# EasyEDA schematic V2.json
TITLE: Sheet_1; REV: 1.0; Date: 2022-11-14; Sheet: 1/1; Company: Your Company
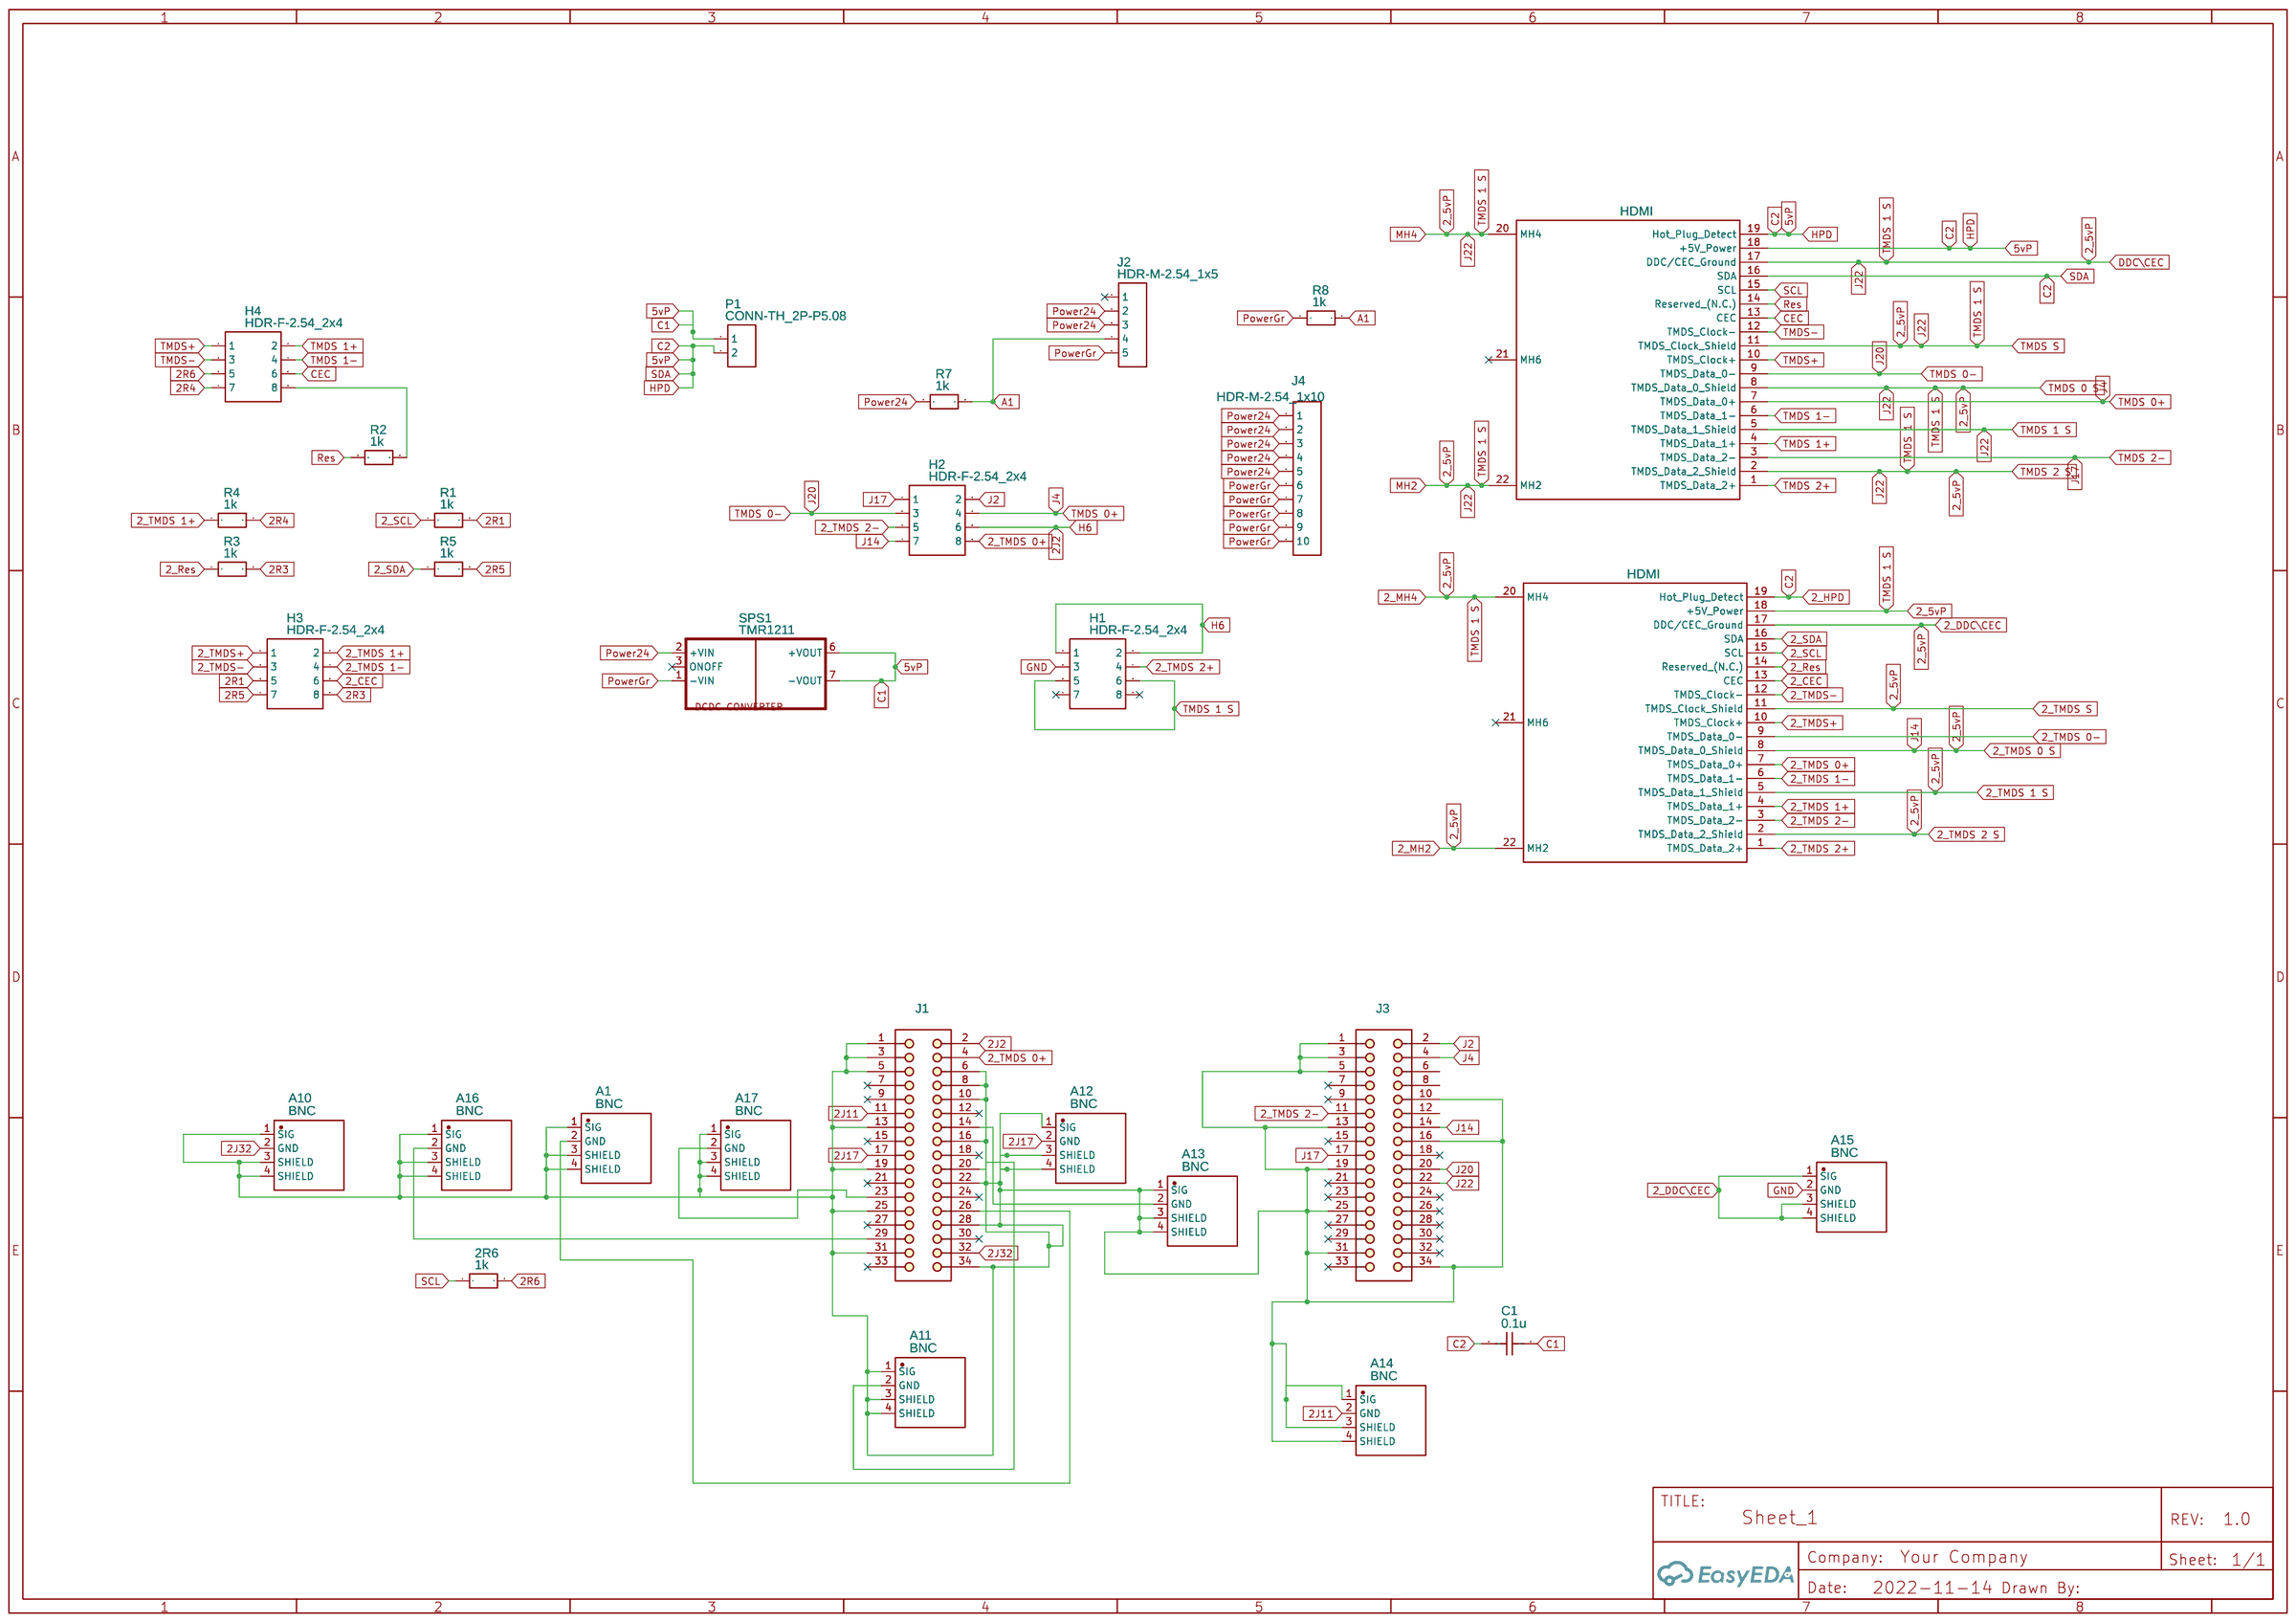
[diagram p0: schematic sheet]

## Parts
2R6  1k  [R0603]
A1  BNC  [BNC-TH_DOSIN-801-0039]
A10  BNC  [BNC-TH_DOSIN-801-0039]
A11  BNC  [BNC-TH_DOSIN-801-0039]
A12  BNC  [BNC-TH_DOSIN-801-0039]
A13  BNC  [BNC-TH_DOSIN-801-0039]
A14  BNC  [BNC-TH_DOSIN-801-0039]
A15  BNC  [BNC-TH_DOSIN-801-0039]
A16  BNC  [BNC-TH_DOSIN-801-0039]
A17  BNC  [BNC-TH_DOSIN-801-0039]
C1  0.1u  [C0603]
H1  HDR-F-2.54_2x4  [HDR-F-2.54_2X4]
H2  HDR-F-2.54_2x4  [HDR-F-2.54_2X4]
H3  HDR-F-2.54_2x4  [HDR-F-2.54_2X4]
H4  HDR-F-2.54_2x4  [HDR-F-2.54_2X4]
J1  09 18 134 9621  [9181349621]
J2  HDR-M-2.54_1x5  [HDR-M-2.54_1X5]
J3  09 18 134 9621  [9181349621]
J4  HDR-M-2.54_1x10  [HDR-M-2.54_1X10]
P1  CONN-TH_2P-P5.08  [CONN-TH_2P-P5.08]
R1  1k  [R0603]
R2  1k  [R0603]
R3  1k  [R0603]
R4  1k  [R0603]
R5  1k  [R0603]
R7  1k  [R0603]
R8  1k  [R0603]
SPS1  TMR1211  [TRACO_SIP-8]
U1  HDMI  [HDMI-SMD_SOFNG_HDMI-019L-S]
U2  HDMI  [HDMI-SMD_SOFNG_HDMI-019L-S]

## Library data of the parts
2R6 R1-R5 R7 R8 = R_0603_EU: Contributor: LCEDA_Lib
A1 A10-A17 = DOSIN-801-0039: Supplier: LCSC; Supplier Part: C709674; Manufacturer: dosinconn(德索五金); Contributor: LCSC; JLCPCB Part Class: Extended Part
C1 = C_0603_US: Contributor: LCEDA_Lib
H1-H4 = HDR-F-2.54_2x4: Supplier Part: C239344; Supplier: LCSC; Contributor: LCEDA_Lib
J1 J3 = 09 18 134 9621: Flat Cable Connector (IDC), PCB Transition Connector, 2 Rows, Solder Pin, 34 Contacts
J2 = HDR-M-2.54_1x5: Supplier Part: C358687; Supplier: LCSC; Contributor: LCEDA_Lib
J4 = HDR-M-2.54_1x10: Supplier Part: C57369; Supplier: LCSC; Contributor: LCEDA_Lib
P1 = CONN-TH_2P-P5.08: Supplier: LCSC; Contributor: LCEDA_Lib
SPS1 = TMR1211
U1 U2 = HDMI-019L-S: Supplier: LCSC; Supplier Part: C3021272; Manufacturer: SOFNG(硕方); link: https://atta.szlcsc.com/upload/public/pdf/source/20220608/3D9160E2F684E26C65B76B425393818C.pdf; Contributor: lcsc; JLCPCB Part Class: Extended Part

## Nets
GND: A15.2(GND) H1.3
2_5vP: A15.1(SIG) A15.3(SHIELD) A15.4(SHIELD) H1.5 H1.6 H2.7 J3.14 J3.22 U1.2(TMDS Data 2 Shield) U1.5(TMDS Data 1 Shield) U1.8(TMDS Data 0 Shield) U1.11(TMDS Clock Shield) U1.17(DDC/CEC Ground) U1.20(MH4) U1.22(MH2) U2.2(TMDS Data 2 Shield) U2.5(TMDS Data 1 Shield) U2.8(TMDS Data 0 Shield) U2.11(TMDS Clock Shield) U2.17(DDC/CEC Ground) U2.18(+5V Power) U2.20(MH4) U2.22(MH2)
2_CEC: H3.6 U2.13(CEC)
2_HPD: C1.1 C1.2 P1.1 P1.2 SPS1.6(+VOUT) SPS1.7(-VOUT) U1.16(SDA) U1.18(+5V Power) U1.19(Hot Plug Detect) U2.19(Hot Plug Detect)
2_Res: R3.1 U2.14(Reserved (N.C.))
2_SCL: R1.1 U2.15(SCL)
2_SDA: R5.1 U2.16(SDA)
2_TMDS 0+: H2.8 J1.4 U2.7(TMDS Data 0+)
2_TMDS 0-: U2.9(TMDS Data 0-)
2_TMDS 1+: H3.2 R4.1 U2.4(TMDS Data 1+)
2_TMDS 1-: H3.4 U2.6(TMDS Data 1-)
2_TMDS 2+: H1.4 U2.1(TMDS Data 2+)
2_TMDS 2-: H2.5 J3.11 U2.3(TMDS Data 2-)
2_TMDS+: H3.1 U2.10(TMDS Clock+)
2_TMDS-: H3.3 U2.12(TMDS Clock-)
2J2: H1.1 H1.2 H2.6 J1.2
2J11: A14.2(GND) J1.11
2J17: A12.2(GND) J1.17
2J32: A10.2(GND) J1.32
2R1: H3.5 R1.2
2R3: H3.8 R3.2
2R4: H4.7 R4.2
2R5: H3.7 R5.2
2R6: 2R6.2 H4.5
A1: J2.4 R7.2 R8.2
CEC: H4.6 U1.13(CEC)
J2: H2.2 J3.2
J4: H2.4 J3.4 U1.7(TMDS Data 0+)
J17: H2.1 J3.17 U1.3(TMDS Data 2-)
J20: H2.3 J3.20 U1.9(TMDS Data 0-)
Power24: J2.2 J2.3 J4.1 J4.2 J4.3 J4.4 J4.5 R7.1 SPS1.2(+VIN)
PowerGr: J2.5 J4.6 J4.7 J4.8 J4.9 J4.10 R8.1 SPS1.1(-VIN)
Res: R2.1 U1.14(Reserved (N.C.))
SCL: 2R6.1 U1.15(SCL)
TMDS 1+: H4.2 U1.4(TMDS Data 1+)
TMDS 1-: H4.4 U1.6(TMDS Data 1-)
TMDS 2+: U1.1(TMDS Data 2+)
TMDS+: H4.1 U1.10(TMDS Clock+)
TMDS-: H4.3 U1.12(TMDS Clock-)
Net-(A1-1): A1.1(SIG) A1.3(SHIELD) A1.4(SHIELD) A10.1(SIG) A10.3(SHIELD) A10.4(SHIELD) A11.1(SIG) A11.3(SHIELD) A11.4(SHIELD) A12.1(SIG) A12.3(SHIELD) A12.4(SHIELD) A13.1(SIG) A13.3(SHIELD) A13.4(SHIELD) A14.1(SIG) A14.3(SHIELD) A14.4(SHIELD) A16.1(SIG) A16.3(SHIELD) A16.4(SHIELD) A17.1(SIG) A17.3(SHIELD) A17.4(SHIELD) J1.1 J1.3 J1.5 J1.6 J1.8 J1.10 J1.13 J1.16 J1.19 J1.22 J1.25 J1.28 J1.31 J1.34 J3.1 J3.3 J3.5 J3.10 J3.13 J3.16 J3.19 J3.25 J3.31 J3.34
Net-(A1-2): A1.2(GND) J1.26
Net-(A11-2): A11.2(GND) J1.20
Net-(A13-2): A13.2(GND) J1.14
Net-(A16-2): A16.2(GND) J1.29
Net-(A17-2): A17.2(GND) J1.23
Net-(H4-8): H4.8 R2.2

Not connected (* = marked no-connect by the designer): H1 7* 8*; J1 7* 9* 12* 15* 18* 21* 24* 27* 30* 33*; J2 1*; J3 6 7* 8 9* 12 15* 18* 21* 23* 24* 26* 27* 28* 29* 30* 32* 33*; SPS1 3(ONOFF)*; U1 21(MH6)*; U2 21(MH6)*
